# Altium schematic sheet mikrokontroler.SchDoc
size A4; DocumentNumber: 6; SheetNumber: 6; SheetTotal: 8
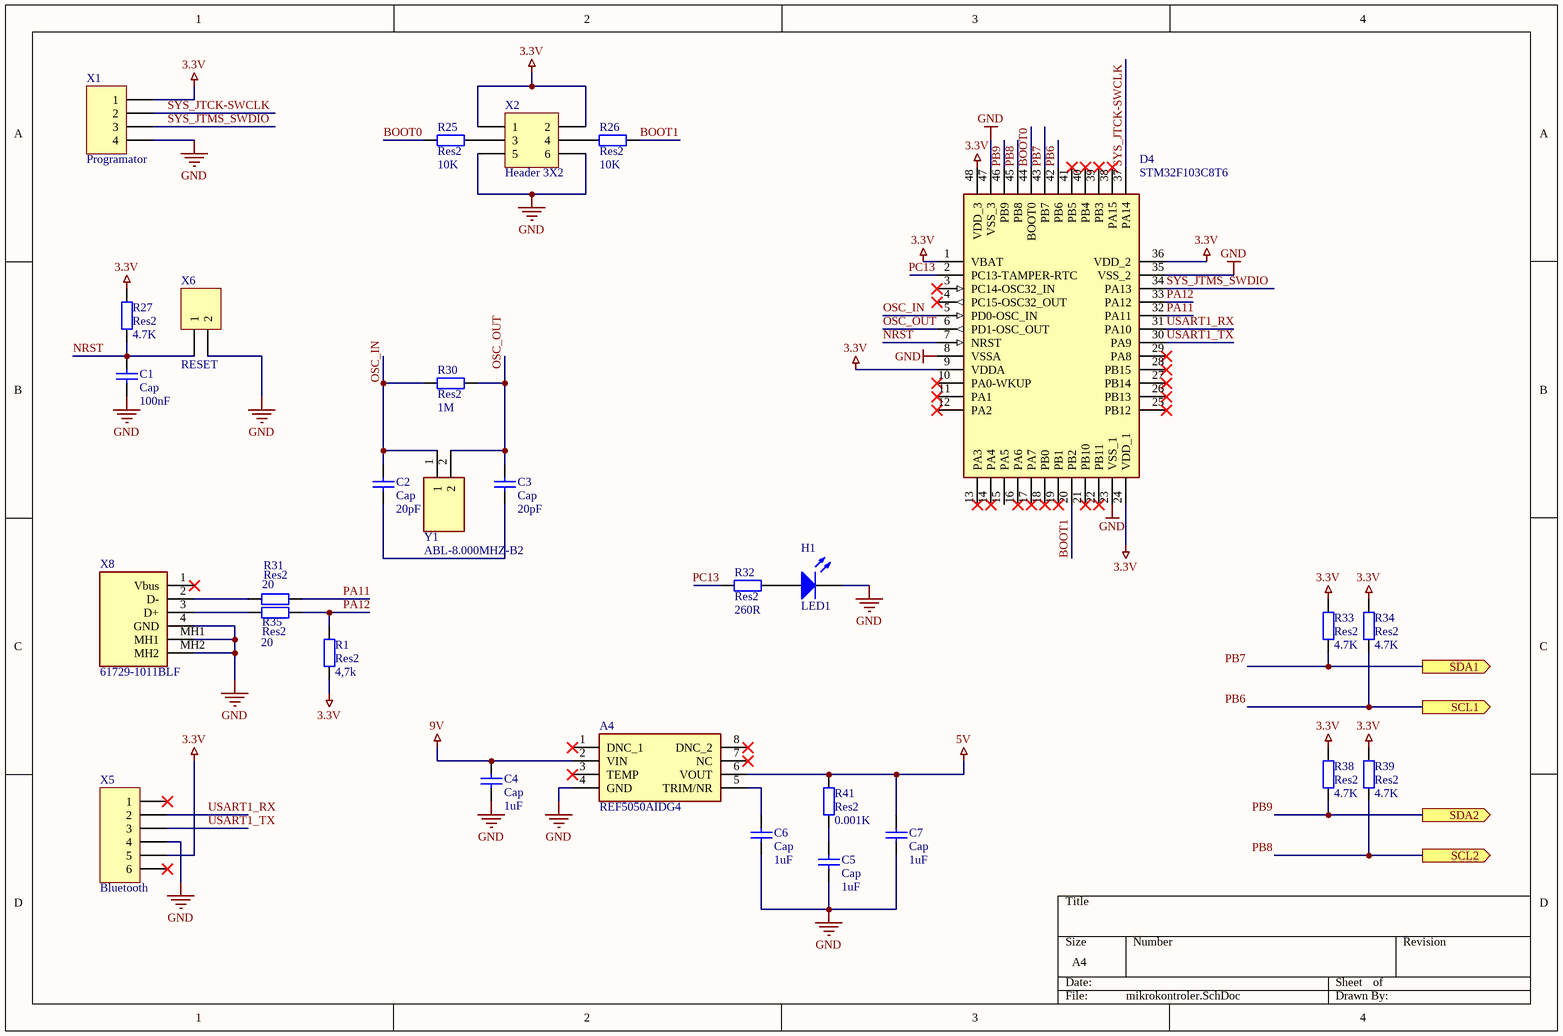
[diagram p0: mikrokontroler.SchDoc]

## Parts
A4  REF5050AIDG4  [SOIC127P600X175-8N]
C1  Cap  value 100nF  [6-0805_L]
C2  Cap  value 20pF  [6-0805_L]
C3  Cap  value 20pF  [6-0805_L]
C4  Cap  value 1uF  [6-0805_L]
C5  Cap  value 1uF  [6-0805_L]
C6  Cap  value 1uF  [6-0805_L]
C7  Cap  value 1uF  [6-0805_L]
D4  STM32F103C8T6  [QFP50P900X900X160-48N]
H1  LED1  [LED-1]
R1  Res2  value 4,7k  [6-0805_L]
R25  Res2  value 10K  [6-0805_L]
R26  Res2  value 10K  [6-0805_L]
R27  Res2  value 4.7K  [6-0805_L]
R30  Res2  value 1M  [6-0805_L]
R31  Res2  value 20  [6-0805_L]
R32  Res2  value 260R  [6-0805_L]
R33  Res2  value 4.7K  [6-0805_L]
R34  Res2  value 4.7K  [6-0805_L]
R35  Res2  value 20  [6-0805_L]
R38  Res2  value 4.7K  [6-0805_L]
R39  Res2  value 4.7K  [6-0805_L]
R41  Res2  value 0.001K  [6-0805_L]
X1  Programator  [HDR1X4]
X2  Header 3X2  [HDR2X3]
X5  Bluetooth  [HDR1X6]
X6  RESET  [HDR1X2]
X8  61729-1011BLF  [617291011BLF]
Y1  ABL-8.000MHZ-B2  [HC/49US_(AT49)PTH]

## Ports
SCL1 (out), SCL2 (out), SDA1 (out), SDA2 (out)

## Nets
3.3V: D4.1(VBAT) D4.9(VDDA) D4.24(VDD_1) D4.36(VDD_2) D4.48(VDD_3) R1.2 R27.2 R33.2 R34.2 R38.2 R39.2 X1.1 X2.1 X2.2 X5.5
5V: A4.6(VOUT) C7.2 R41.1
9V: A4.2(VIN) C4.2
GND: A4.4(GND) C1.1 C4.1 C5.1 C6.1 C7.1 D4.8(VSSA) D4.23(VSS_1) D4.35(VSS_2) D4.47(VSS_3) H1.2(K) X1.4 X2.5 X2.6 X5.4 X6.2 X8.4(GND) X8.MH1 X8.MH2
BOOT0: D4.44(BOOT0) R25.2
BOOT1: D4.20(PB2) R26.1
NRST: C1.2 D4.7(NRST) R27.1 X6.1
OSC_IN: C2.2 D4.5(PD0-OSC_IN) R30.2 Y1.1
OSC_OUT: C3.2 D4.6(PD1-OSC_OUT) R30.1 Y1.2
PA11: D4.32(PA11) R31.1
PA12: D4.33(PA12) R1.1 R35.1
PB6: D4.42(PB6) R34.1 ; port SCL1
PB7: D4.43(PB7) R33.1 ; port SDA1
PB8: D4.45(PB8) R39.1 ; port SCL2
PB9: D4.46(PB9) R38.1 ; port SDA2
PC13: D4.2(PC13-TAMPER-RTC) R32.1
SYS_JTCK-SWCLK: D4.37(PA14) X1.2
SYS_JTMS_SWDIO: D4.34(PA13) X1.3
USART1_RX: D4.31(PA10) X5.2
USART1_TX: D4.30(PA9) X5.3
NetA4_5: A4.5(TRIM/NR) C6.2
NetC2_1: C2.1 C3.1
NetC5_2: C5.2 R41.2
NetH1_1: H1.1(A) R32.2
NetR25_1: R25.1 X2.3
NetR26_2: R26.2 X2.4
NetR31_2: R31.2 X8.2(D-)
NetR35_2: R35.2 X8.3(D+)

Not connected (* = marked no-connect by the designer): A4 1(DNC_1)* 3(TEMP)* 7(NC)* 8(DNC_2)*; D4 3(PC14-OSC32_IN)* 4(PC15-OSC32_OUT)* 10(PA0-WKUP)* 11(PA1)* 12(PA2)* 13(PA3)* 14(PA4)* 15(PA5) 16(PA6)* 17(PA7)* 18(PB0)* 19(PB1)* 21(PB10)* 22(PB11)* 25(PB12)* 26(PB13)* 27(PB14)* 28(PB15)* 29(PA8)* 38(PA15)* 39(PB3)* 40(PB4)* 41(PB5)*; X5 1* 6*; X8 1(Vbus)*

## Library data of the parts
A4 = REF5050AIDG4: Integrated Circuit; Manufacturer_Name: Texas Instruments; Datasheet Link: http://www.ti.com/lit/ds/symlink/ref5050.pdf; Height: 1.75mm; Manufacturer_Part_Number: REF5050AIDG4; Mouser Part Number: 595-REF5050AIDG4; Mouser Price/Stock: https://www.mouser.com/Search/Refine.aspx?Keyword=595-REF5050AIDG4
C1-C7 = Cap: Capacitor; Published: 8-Jun-2000; LatestRevisionDate: 17-Jul-2002; LatestRevisionNote: Re-released for DXP Platform.; PackageReference: RAD-0.3; Publisher: Altium Limited; PackageDescription: Radial Cap, Thru-Hole; 2 Leads; 0.3 in Pin Spacing
D4 = STM32F103C8T6: Integrated Circuit; Manufacturer_Name: STMicroelectronics; Allied_Number: 70390993; Datasheet Link: http://www.st.com/st-web-ui/static/active/en/resource/technical/document/datasheet/CD00161566.pdf; Height: 1.6mm; Manufacturer_Part_Number: STM32F103C8T6; Mouser Part Number: 511-STM32F103C8T6; Mouser Price/Stock: https://www.mouser.com/Search/Refine.aspx?Keyword=511-STM32F103C8T6; RS Part Number: 0402279P; RS Price/Stock: http://uk.rs-online.com/web/p/products/0402279P; Allied Price/Stock: http://www.alliedelec.com/stmicroelectronics-stm32f103c8t6/70390993/
H1 = LED1: Typical RED GaAs LED; Published: 8-Jun-2000; LatestRevisionDate: 08-Jul-2005; LatestRevisionNote: Mech Layer 1 removed.; PackageReference: LED-1; Publisher: Altium Limited; PackageDescription: LED; 2 Leads
R1 R25-R27 R30-R35 R38 R39 R41 = Res2: Resistor; Published: 8-Jun-2000; LatestRevisionDate: 17-Jul-2002; LatestRevisionNote: Re-released for DXP Platform.; PackageReference: AXIAL-0.4; Publisher: Altium Limited; PackageDescription: Axial Device, Thru-Hole; 2 Leads; 0.4 in Pin Spacing
X1 = Header 4: Header, 4-Pin; LatestRevisionDate: 17-Jul-2002; LatestRevisionNote: Re-released for DXP Platform.; Publisher: Altium Limited
X2 = Header 3X2: Header, 3-Pin, Dual row; LatestRevisionDate: 17-Jul-2002; LatestRevisionNote: Re-released for DXP Platform.; Publisher: Altium Limited
X5 = Header 6: Header, 6-Pin; LatestRevisionDate: 17-Jul-2002; LatestRevisionNote: Re-released for DXP Platform.; Publisher: Altium Limited
X6 = Header 2: Header, 2-Pin; LatestRevisionDate: 17-Jul-2002; LatestRevisionNote: Re-released for DXP Platform.; Publisher: Altium Limited
X8 = 61729-1011BLF: Connector; Manufacturer_Name: Amphenol; Allied_Number: 70236839; Datasheet Link: https://www.mouser.com/datasheet/2/18/61729-1363119.pdf; Height: 11.5mm; Manufacturer_Part_Number: 61729-1011BLF; Mouser Part Number: 649-61729-1011BLF; Mouser Price/Stock: https://www.mouser.com/Search/Refine.aspx?Keyword=649-61729-1011BLF; RS Part Number: 7710041; RS Price/Stock: http://uk.rs-online.com/web/p/products/7710041; Allied Price/Stock: https://www.alliedelec.com/amphenol-fci-61729-1011blf/70236839/
Y1 = ABL-8.000MHZ-B2: Crystal or Oscillator; Manufacturer_Name: ABRACON; Datasheet Link: http://www.abracon.com/Resonators/ABL.pdf; Manufacturer_Part_Number: ABL-8.000MHZ-B2; Mouser Part Number: 815-ABL-8-B2; Mouser Price/Stock: https://www.mouser.co.uk/ProductDetail/ABRACON/ABL-8000MHZ-B2?qs=zLkLEWnxMJxHYmzIauBRTw%3D%3D; RS Part Number: 1710614; RS Price/Stock: http://uk.rs-online.com/web/p/products/1710614